# Altium schematic sheet audio.SchDoc
size A; SheetNumber: 3; SheetTotal: 3
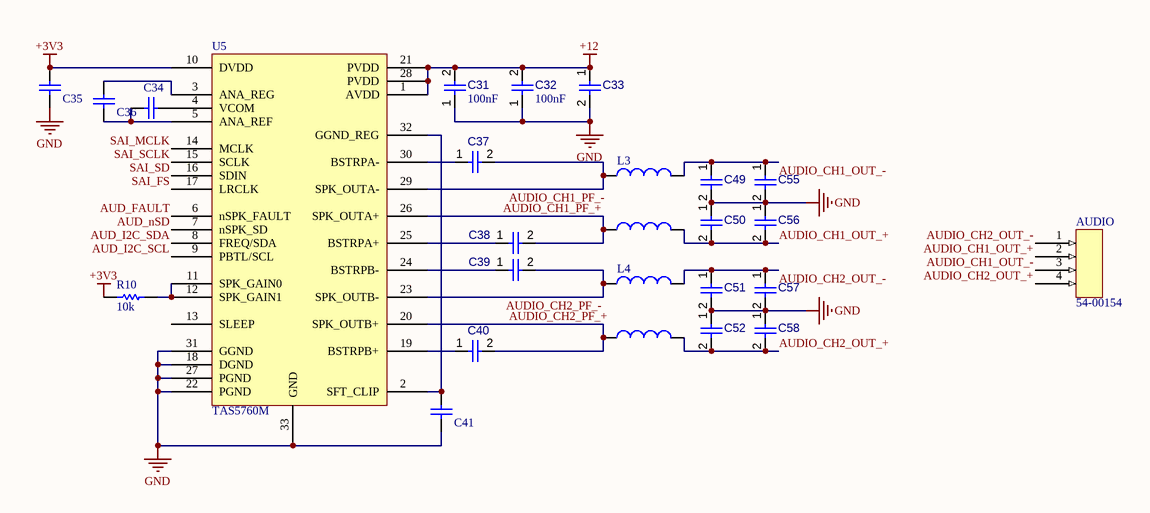
[diagram p0: audio.SchDoc]

## Parts
AUDIO  54-00154  [54-00154-Footprint-1]
C31  value 100nF  [CAPC0402(1005)60_L]  (hidden comment: Capacitor 100nF +/-20% 25V 0402)
C32  value 100nF  [CAPC0402(1005)60_L]  (hidden comment: Capacitor 100nF +/-20% 25V 0402)
C33  T59EE477M016C0025  [CAPC7343X43N]  (value not drawn)
C34  TACL105M016XTA  [CAPC1609X100X15NL20]  (value not drawn)
C35  TACL105M016XTA  [CAPC1609X100X15NL20]  (value not drawn)
C36  TACL105M016XTA  [CAPC1609X100X15NL20]  (value not drawn)
C37  16MU224MZ22012  [CAPC2014X10N]  (value not drawn)
C38  16MU224MZ22012  [CAPC2014X10N]  (value not drawn)
C39  16MU224MZ22012  [CAPC2014X10N]  (value not drawn)
C40  16MU224MZ22012  [CAPC2014X10N]  (value not drawn)
C41  TACL105M016XTA  [CAPC1609X100X15NL20]  (value not drawn)
C49  16MU224MZ22012  [CAPC2014X10N]  (value not drawn)
C50  16MU224MZ22012  [CAPC2014X10N]  (value not drawn)
C51  16MU224MZ22012  [CAPC2014X10N]  (value not drawn)
C52  16MU224MZ22012  [CAPC2014X10N]  (value not drawn)
C55  16MU224MZ22012  [CAPC2014X10N]  (value not drawn)
C56  16MU224MZ22012  [CAPC2014X10N]  (value not drawn)
C57  16MU224MZ22012  [CAPC2014X10N]  (value not drawn)
C58  16MU224MZ22012  [CAPC2014X10N]  (value not drawn)
L3  ACDL2V0910-100-R  [ACDL2V0910-100-R-Footprint-1]  (value not drawn)
L4  ACDL2V0910-100-R  [ACDL2V0910-100-R-Footprint-1]  (value not drawn)
R10  10k  [RESC1609X50X30NL8T20]
U5  TAS5760M  [TSOP65P810X120_HS-33N]

## Nets
+3V3: C35.2 R10.2 U5.10(DVDD)
+12: C31.2 C32.2 C33.1 U5.1(AVDD) U5.21(PVDD) U5.28(PVDD)
GND: C31.1 C32.1 C33.2 C35.1 C41.2 C49.2 C50.1 C51.2 C52.1 C55.2 C56.1 C57.2 C58.1 U5.18(DGND) U5.22(PGND) U5.27(PGND) U5.31(GGND) U5.33(GND)
AUD_FAULT: U5.6(nSPK_FAULT)
AUD_I2C_SCL: U5.9(PBTL/SCL)
AUD_I2C_SDA: U5.8(FREQ/SDA)
AUD_nSD: U5.7(nSPK_SD)
AUDIO_CH1_OUT_+: AUDIO.2 C50.2 C56.2 L3.4
AUDIO_CH1_OUT_-: AUDIO.3 C49.1 C55.1 L3.2
AUDIO_CH1_PF_+: C38.2 L3.3 U5.26(SPK_OUTA+)
AUDIO_CH1_PF_-: C37.2 L3.1 U5.29(SPK_OUTA-)
AUDIO_CH2_OUT_+: AUDIO.4 C52.2 C58.2 L4.4
AUDIO_CH2_OUT_-: AUDIO.1 C51.1 C57.1 L4.2
AUDIO_CH2_PF_+: C40.2 L4.3 U5.20(SPK_OUTB+)
AUDIO_CH2_PF_-: C39.2 L4.1 U5.23(SPK_OUTB-)
SAI_FS: U5.17(LRCLK)
SAI_MCLK: U5.14(MCLK)
SAI_SCLK: U5.15(SCLK)
SAI_SD: U5.16(SDIN)
NetC34_1: C34.1 C36.1 U5.5(ANA_REF)
NetC34_2: C34.2 U5.4(VCOM)
NetC36_2: C36.2 U5.3(ANA_REG)
NetC37_1: C37.1 U5.30(BSTRPA-)
NetC38_1: C38.1 U5.25(BSTRPA+)
NetC39_1: C39.1 U5.24(BSTRPB-)
NetC40_1: C40.1 U5.19(BSTRPB+)
NetC41_1: C41.1 U5.2(SFT_CLIP) U5.32(GGND_REG)
NetR10_1: R10.1 U5.11(SPK_GAIN0) U5.12(SPK_GAIN1)

Not connected (* = marked no-connect by the designer): U5 13(SLEEP)

## Library data of the parts
AUDIO = CMP-002-00074-1: Conn Rcpt Fmale Pnl Mnt 4POS
C31 C32 = CMP-001-00065-4: Chip Capacitor, 100nF +/-20%, 25V, 0402, Thickness 0.6 mm; Tolerance: 10%; Max Operating Temperature: 85°C; Min Operating Temperature: -55°C; Pins: 2; Voltage Rating: 25V; Mounting Technology: SMT; Case/Package: 0402
C33 = CMP-001-00085-1: Tantalum Capacitor, Polarized, Tantalum (solid Polymer), 16V, 20% +Tol, 20% -Tol, 470uF, Surface Mount, 2917; Pins: 2; RoHS Compliant: Yes; Capacitor Type: Tantalum
C34-C36 C41 = CMP-2006-00188-1: Manufacturer: AVX Interconnect / Elco; Part Number: TACL105M016XTA
C37-C40 C49-C52 C55-C58 = CMP-001-00084-1: Film Capacitor, 16V, 20% +Tol, 20% -Tol, 0.22uF, Surface Mount, 0805; Capacitor Type: Aluminium; RoHS Compliant: Yes; Pins: 2
L3 L4 = CMP-006-00024-1: 2 ch inductor for audio
R10 = CMP-1666-00005-4: Chip Resistor, 10 KOhm, +/- 1%, 100 mW, -55 to 155 degC, 0603 (1608 Metric), RoHS, Tape and Reel; Manufacturer: Vishay Semiconductor; Voltage Rating: 75 V; Value: 1K; Max Operating Temperature: 155 degC; PackageDescription: 2-Pin Surface Mount Device, Body 1.575 x 0.85 mm; ComponentLink1Description: Manufacturer URL; RoHSCompliant: true; PackageReference: 0603; REACH SVHC: Unknown; Length: 1.55 mm; DatasheetVersion: 06/2012; Packaging: Tape and Reel; Min Operating Temperature: -55 degC; Mounting Technology: Surface Mount; ComponentLink2URL: https://datasheet.ciiva.com/11809/0900766b80d98afc-11809037.pdf; Height: 0.45 mm; ComponentLink2Description: Datasheet; Package Quantity: 5000; ComponentLink1URL: http://www.vishay.com/
U5 = CMP-014-00002-2